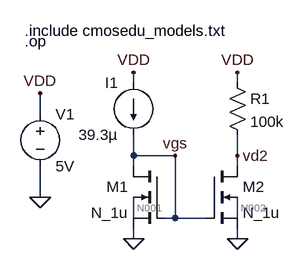
[diagram p0: schematic Circuito-4.asc]
Circuito-4.asc, the LTspice schematic file:
Version 4
SHEET 1 880 680
WIRE 192 -48 192 -64
WIRE 352 -48 352 -64
WIRE 48 0 48 -32
WIRE 192 64 192 32
WIRE 256 64 192 64
WIRE 352 64 352 32
WIRE 192 80 192 64
WIRE 352 80 352 64
WIRE 48 128 48 80
WIRE 192 160 192 128
WIRE 256 160 256 64
WIRE 256 160 240 160
WIRE 304 160 256 160
WIRE 352 160 352 128
WIRE 192 192 192 176
WIRE 352 192 352 176
FLAG 48 128 0
FLAG 192 192 0
FLAG 256 64 vgs
FLAG 48 -32 VDD
FLAG 192 -64 VDD
FLAG 352 -64 VDD
FLAG 352 192 0
FLAG 352 64 vd2
SYMBOL voltage 48 -16 R0
WINDOW 123 0 0 Left 2
WINDOW 39 0 0 Left 2
SYMATTR InstName V1
SYMATTR Value 5V
SYMBOL nmos4 240 80 M0
SYMATTR InstName M1
SYMATTR Value N_1u
SYMATTR Value2 l=1.5u w=3u
SYMBOL current 192 -48 M0
WINDOW 123 0 0 Left 2
WINDOW 39 0 0 Left 2
SYMATTR InstName I1
SYMATTR Value 39.3µ
SYMBOL res 336 -64 R0
SYMATTR InstName R1
SYMATTR Value 100k
SYMBOL nmos4 304 80 R0
SYMATTR InstName M2
SYMATTR Value N_1u
SYMATTR Value2 l=1.5u w=3u
TEXT 24 -128 Left 2 !.include cmosedu_models.txt
TEXT 24 -112 Left 2 !.op

The netlist it stands for:
* Circuito-4.asc
V1 VDD 0 5V
M1 vgs vgs 0 N001 N_1u l=1.5u w=3u
I1 VDD vgs 39.3µ
R1 VDD vd2 100k
M2 vd2 vgs 0 N002 N_1u l=1.5u w=3u
.model NMOS NMOS
.model PMOS PMOS
.lib standard.mos
.include cmosedu_models.txt
.op
.backanno
.end

* Results of the author's LTspice run, read from the files saved beside the schematic
* Operating Point:
*   V(vdd) = 5 V
*   V(vgs) = 1.464 V
*   V(n001) = 124.6 mV
*   V(vd2) = 1.126 V
*   V(n002) = 116.7 mV
*   Id(M2) = 38.74 µA
*   Ig(M2) = 0 A
*   Ib(M2) = 0 A
*   Is(M2) = -38.74 µA
*   Id(M1) = 39.3 µA
*   Ig(M1) = 0 A
*   Ib(M1) = 0 A
*   Is(M1) = -39.3 µA
*   I(I1) = 39.3 µA
*   I(R1) = 38.74 µA
*   I(V1) = -78.04 µA
* From the log:
*   Semiconductor Device Operating Points:
*                           --- MOSFET Transistors ---
*   Name:          m2          m1
*   Model:        n_1u        n_1u
*   Id:          3.87e-05    3.93e-05
*   Vgs:         1.46e+00    1.46e+00
*   Vds:         1.13e+00    1.46e+00
*   Vbs:         1.17e-01    1.25e-01
*   Vth:         8.53e-01    8.51e-01
*   Vdsat:       4.71e-01    4.72e-01
*   Gm:          9.97e-05    1.01e-04
*   Gds:         4.40e-06    4.28e-06
*   Gmb:         3.02e-05    3.03e-05
*   Cbd:         0.00e+00    0.00e+00
*   Cbs:         0.00e+00    0.00e+00
*   Cgsov:       6.00e-16    6.00e-16
*   Cgdov:       6.00e-16    6.00e-16
*   Cgbov:       1.30e-16    1.30e-16
*   Cgs:         4.49e-15    4.49e-15
*   Cgd:         0.00e+00    0.00e+00
*   Cgb:         0.00e+00    0.00e+00